# Altium schematic sheet InterfaceConnector.SchDoc
size A3; SheetNumber: 1; SheetTotal: 1; PageSetup: Record=PageOptions|CenterHorizontal=True|CenterVertical=True|PrintScale=0.97|XCorrection=1.00|YCorrection=1.00|PrintKind=1|BorderSize=5000000|LeftOffset=0|BottomOffset=0|Orientation=2|PaperLength=2970|PaperWidth=2100|Scale=100|PaperSource=7|PrintQuality=600|MediaType=1|DitherType=10|PaperKind=A4|PrintScaleMode=1
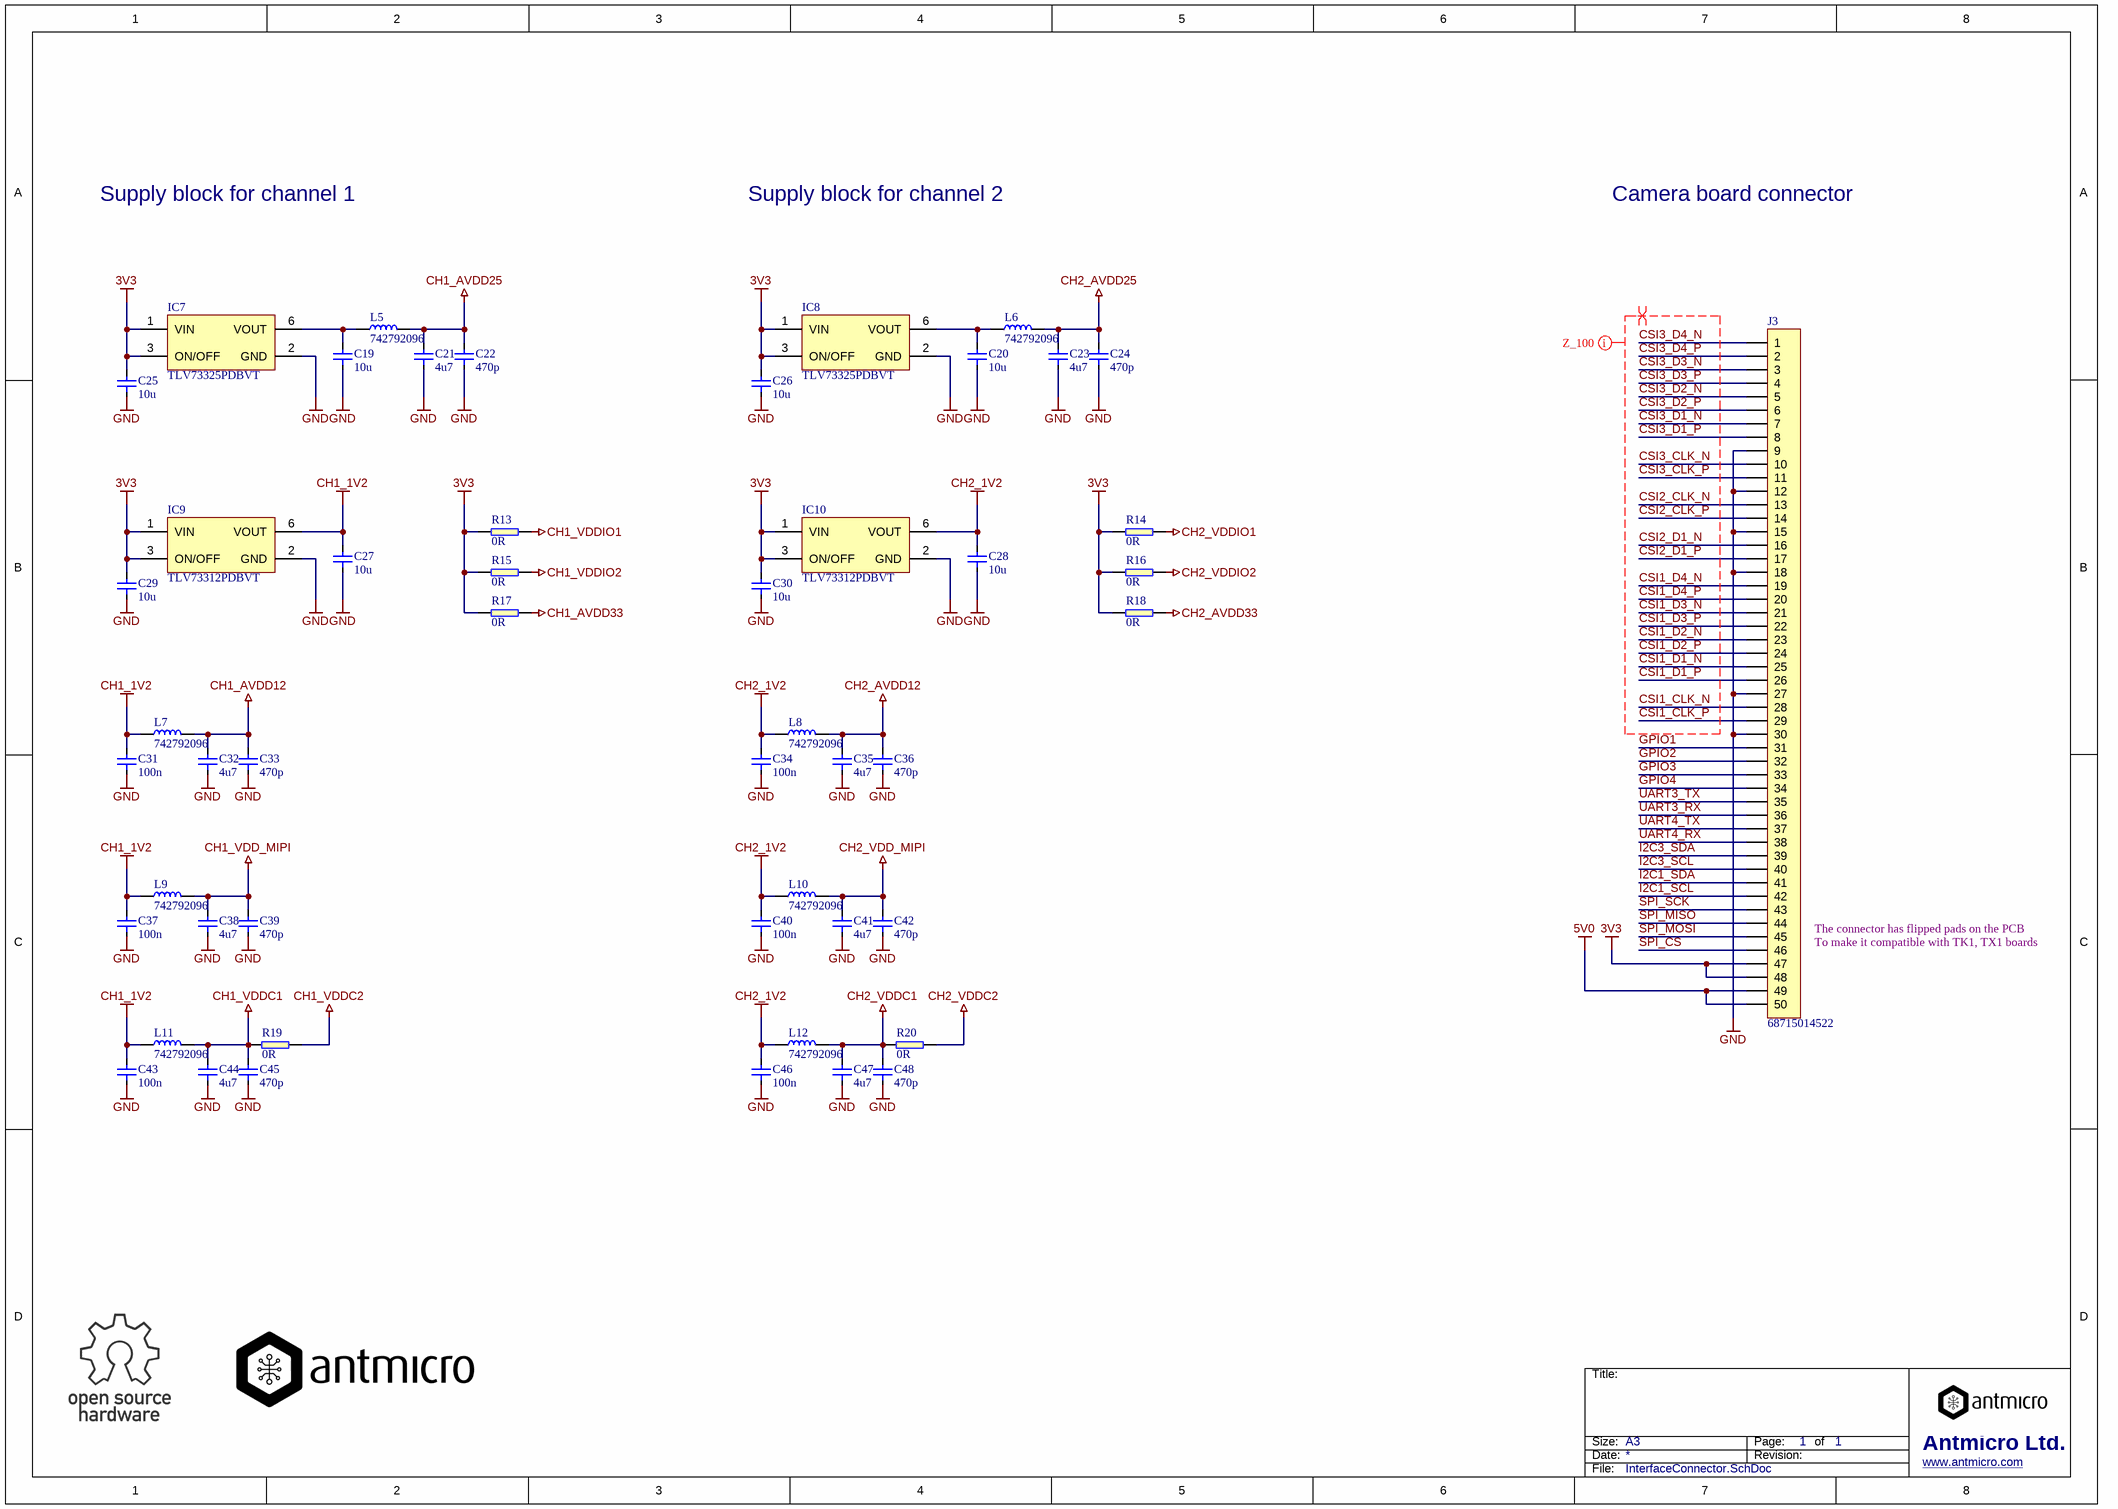
[diagram p0: InterfaceConnector.SchDoc]

## Parts
C19  10u  [0603]
C20  10u  [0603]
C21  4u7  [0402]
C22  470p  [0402]
C23  4u7  [0402]
C24  470p  [0402]
C25  10u  [0603]
C26  10u  [0603]
C27  10u  [0603]
C28  10u  [0603]
C29  10u  [0603]
C30  10u  [0603]
C31  100n  [0402]
C32  4u7  [0402]
C33  470p  [0402]
C34  100n  [0402]
C35  4u7  [0402]
C36  470p  [0402]
C37  100n  [0402]
C38  4u7  [0402]
C39  470p  [0402]
C40  100n  [0402]
C41  4u7  [0402]
C42  470p  [0402]
C43  100n  [0402]
C44  4u7  [0402]
C45  470p  [0402]
C46  100n  [0402]
C47  4u7  [0402]
C48  470p  [0402]
IC7  TLV73325PDBVT  [SOT23-5N]
IC8  TLV73325PDBVT  [SOT23-5N]
IC9  TLV73312PDBVT  [SOT23-5N]
IC10  TLV73312PDBVT  [SOT23-5N]
J3  68715014522  [68715014522_FLIPPED]
L5  742792096  [0805]
L6  742792096  [0805]
L7  742792096  [0805]
L8  742792096  [0805]
L9  742792096  [0805]
L10  742792096  [0805]
L11  742792096  [0805]
L12  742792096  [0805]
R13  0R  [0603]
R14  0R  [0603]
R15  0R  [0603]
R16  0R  [0603]
R17  0R  [0603]
R18  0R  [0603]
R19  0R  [0603]
R20  0R  [0603]

## Nets
3V3: C25.2 C26.2 C29.2 C30.2 IC7.1(VIN) IC7.3(ON/OFF) IC8.1(VIN) IC8.3(ON/OFF) IC9.1(VIN) IC9.3(ON/OFF) IC10.1(VIN) IC10.3(ON/OFF) J3.47 J3.48 R13.1 R14.1 R15.1 R16.1 R17.1 R18.1
5V0: J3.49 J3.50
CH1_1V2: C27.2 C31.2 C37.2 C43.2 IC9.6(VOUT) L7.1 L9.1 L11.1
CH1_AVDD12: C32.2 C33.2 L7.2
CH1_AVDD25: C21.2 C22.2 L5.2
CH1_AVDD33: R17.2
CH1_VDD_MIPI: C38.2 C39.2 L9.2
CH1_VDDC1: C44.2 C45.2 L11.2 R19.1
CH1_VDDC2: R19.2
CH1_VDDIO1: R13.2
CH1_VDDIO2: R15.2
CH2_1V2: C28.2 C34.2 C40.2 C46.2 IC10.6(VOUT) L8.1 L10.1 L12.1
CH2_AVDD12: C35.2 C36.2 L8.2
CH2_AVDD25: C23.2 C24.2 L6.2
CH2_AVDD33: R18.2
CH2_VDD_MIPI: C41.2 C42.2 L10.2
CH2_VDDC1: C47.2 C48.2 L12.2 R20.1
CH2_VDDC2: R20.2
CH2_VDDIO1: R14.2
CH2_VDDIO2: R16.2
GND: C19.1 C20.1 C21.1 C22.1 C23.1 C24.1 C25.1 C26.1 C27.1 C28.1 C29.1 C30.1 C31.1 C32.1 C33.1 C34.1 C35.1 C36.1 C37.1 C38.1 C39.1 C40.1 C41.1 C42.1 C43.1 C44.1 C45.1 C46.1 C47.1 C48.1 IC7.2(GND) IC8.2(GND) IC9.2(GND) IC10.2(GND) J3.9 J3.12 J3.15 J3.18 J3.27 J3.30
CSI1_CLK_N: J3.28
CSI1_CLK_P: J3.29
CSI1_D1_N: J3.25
CSI1_D1_P: J3.26
CSI1_D2_N: J3.23
CSI1_D2_P: J3.24
CSI1_D3_N: J3.21
CSI1_D3_P: J3.22
CSI1_D4_N: J3.19
CSI1_D4_P: J3.20
CSI2_CLK_N: J3.13
CSI2_CLK_P: J3.14
CSI2_D1_N: J3.16
CSI2_D1_P: J3.17
CSI3_CLK_N: J3.10
CSI3_CLK_P: J3.11
CSI3_D1_N: J3.7
CSI3_D1_P: J3.8
CSI3_D2_N: J3.5
CSI3_D2_P: J3.6
CSI3_D3_N: J3.3
CSI3_D3_P: J3.4
CSI3_D4_N: J3.1
CSI3_D4_P: J3.2
GPIO1: J3.31
GPIO2: J3.32
GPIO3: J3.33
GPIO4: J3.34
I2C1_SCL: J3.42
I2C1_SDA: J3.41
I2C3_SCL: J3.40
I2C3_SDA: J3.39
SPI_CS: J3.46
SPI_MISO: J3.44
SPI_MOSI: J3.45
SPI_SCK: J3.43
UART3_RX: J3.36
UART3_TX: J3.35
UART4_RX: J3.38
UART4_TX: J3.37
NetC19_2: C19.2 IC7.6(VOUT) L5.1
NetC20_2: C20.2 IC8.6(VOUT) L6.1

## Layout directives
differential pair: CSI1_CLK_N, CSI1_CLK_P, CSI1_D1_N, CSI1_D1_P, CSI1_D2_N, CSI1_D2_P, CSI1_D3_N, CSI1_D3_P, CSI1_D4_N, CSI1_D4_P, CSI2_CLK_N, CSI2_CLK_P, CSI2_D1_N, CSI2_D1_P, CSI3_CLK_N, CSI3_CLK_P, CSI3_D1_N, CSI3_D1_P, CSI3_D2_N, CSI3_D2_P, CSI3_D3_N, CSI3_D3_P, CSI3_D4_N, CSI3_D4_P
net class Z_100: CSI1_CLK_N, CSI1_CLK_P, CSI1_D1_N, CSI1_D1_P, CSI1_D2_N, CSI1_D2_P, CSI1_D3_N, CSI1_D3_P, CSI1_D4_N, CSI1_D4_P, CSI2_CLK_N, CSI2_CLK_P, CSI2_D1_N, CSI2_D1_P, CSI3_CLK_N, CSI3_CLK_P, CSI3_D1_N, CSI3_D1_P, CSI3_D2_N, CSI3_D2_P, CSI3_D3_N, CSI3_D3_P, CSI3_D4_N, CSI3_D4_P

## Notes on the sheet
- Supply block for channel 1
- Supply block for channel 2
- Camera board connector
- (near J3) The connector has flipped pads on the PCB
- (near J3) To make it compatible with TK1, TX1 boards
- Title:
- Size:
- Date:
- A3
- Revision:
- Page:
- of
- Antmicro Ltd.
- File:
- www.antmicro.com

## Library data of the parts
C19 C20 C25-C30 = C_10u_0603: MLCC SMT Capacitor 10uF 0603; Manufacturer: MULTICOMP; MPN: MC0603X106M6R3CT; Part Number: C_10u_0603; Value: 10u; Supplier 1: Farnell; Supplier Part Number 1: 1759393
C21 C23 C32 C35 C38 C41 C44 C47 = C_4u7_0402: MLCC SMT Capacitor 4u7F 0603; Manufacturer: MURATA; MPN: GRM155R60G475ME; Part Number: C_4u7_0402; Value: 4u7; Supplier 1: Farnell; Supplier Part Number 1: 1735525
C22 C24 C33 C36 C39 C42 C45 C48 = C_470p_0402: MLCC SMT Capacitor 470pF 0402; Manufacturer: MULTICOMP; MPN: MC0402B471J500CT; Part Number: C_470p_0402; Value: 470p; Supplier 1: Farnell; Supplier Part Number 1: 2320771
C31 C34 C37 C40 C43 C46 = C_100n_0402: MLCC SMT Capacitor 100nF 0402; Manufacturer: MULTICOMP; MPN: MC0402X104M100CT; Part Number: C_100n_0402; Value: 100n; Supplier 1: Farnell; Supplier Part Number 1: 2309011
IC7 IC8 = TLV73325PDBVT: Linear Voltage Regulator IC Positive Fixed Output 2.5V 300mA SOT-23-5; Manufacturer: TEXAS INSTRUMENTS; Part Number: TLV73325PDBVT; Value: TLV73325PDBVT; Supplier 1: Farnell; Supplier Part Number 1: 2455143; MPN: TLV73325PDBVT
IC9 IC10 = TLV73312PDBVT: Linear Voltage Regulator IC Positive Fixed Output 3.3V 300mA SOT-23-5; Manufacturer: TEXAS INSTRUMENTS; Part Number: TLV73312PDBVT; Value: TLV73312PDBVT; Supplier 1: Farnell; Supplier Part Number 1: 2455137; MPN: TLV73312PDBVT
J3 = WE-687-150-145-22_FLIPPED: 0.50mm SMT ZIF Horizontal Bottom Contact WR-FPC; Manufacturer: WURTH ELEKTRONIK; Part Number: WE-687-150-145-22_FLIPPED; Supplier Part Number 1: 1908481; Value: 68715014522; Supplier 1: Farnell; MPN: 68715014522
L5-L12 = Wurth-742792096: FERRITE BEAD, 1kOhm 1A; Manufacturer: WURTH ELEKTRONIK; Part Number: Wurth-742792096; Value: 742792096; Supplier 1: Farnell; Supplier Part Number 1: 1635737; MPN: 742792096
R13-R20 = R_0R_0603: SMT Resistor 0R 0603; Manufacturer: BOURNS; MPN: CR0603-J/-000ELF; Part Number: R_0R_0603; Value: 0R; Supplier 1: Farnell; Supplier Part Number 1: 2008343